# EAGLE schematic sum_I1_two_by_two_array (EAGLE 9.3.0)
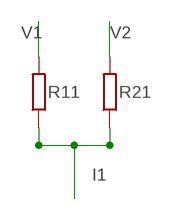
[diagram p0: schematic, sheet 1]

## Parts
R11  R-EU_0204/2V  [0204V]
R21  R-EU_0204/2V  [0204V]

## Nets
I1: R11.1 R21.1
V1: R11.2
V2: R21.2

## Library data of the parts
R11 R21 = resistor:R-EU_: RESISTOR, European symbol